# Altium schematic sheet Shels_System_ADP.SchDoc
size A4; SheetNumber: 1; SheetTotal: 1
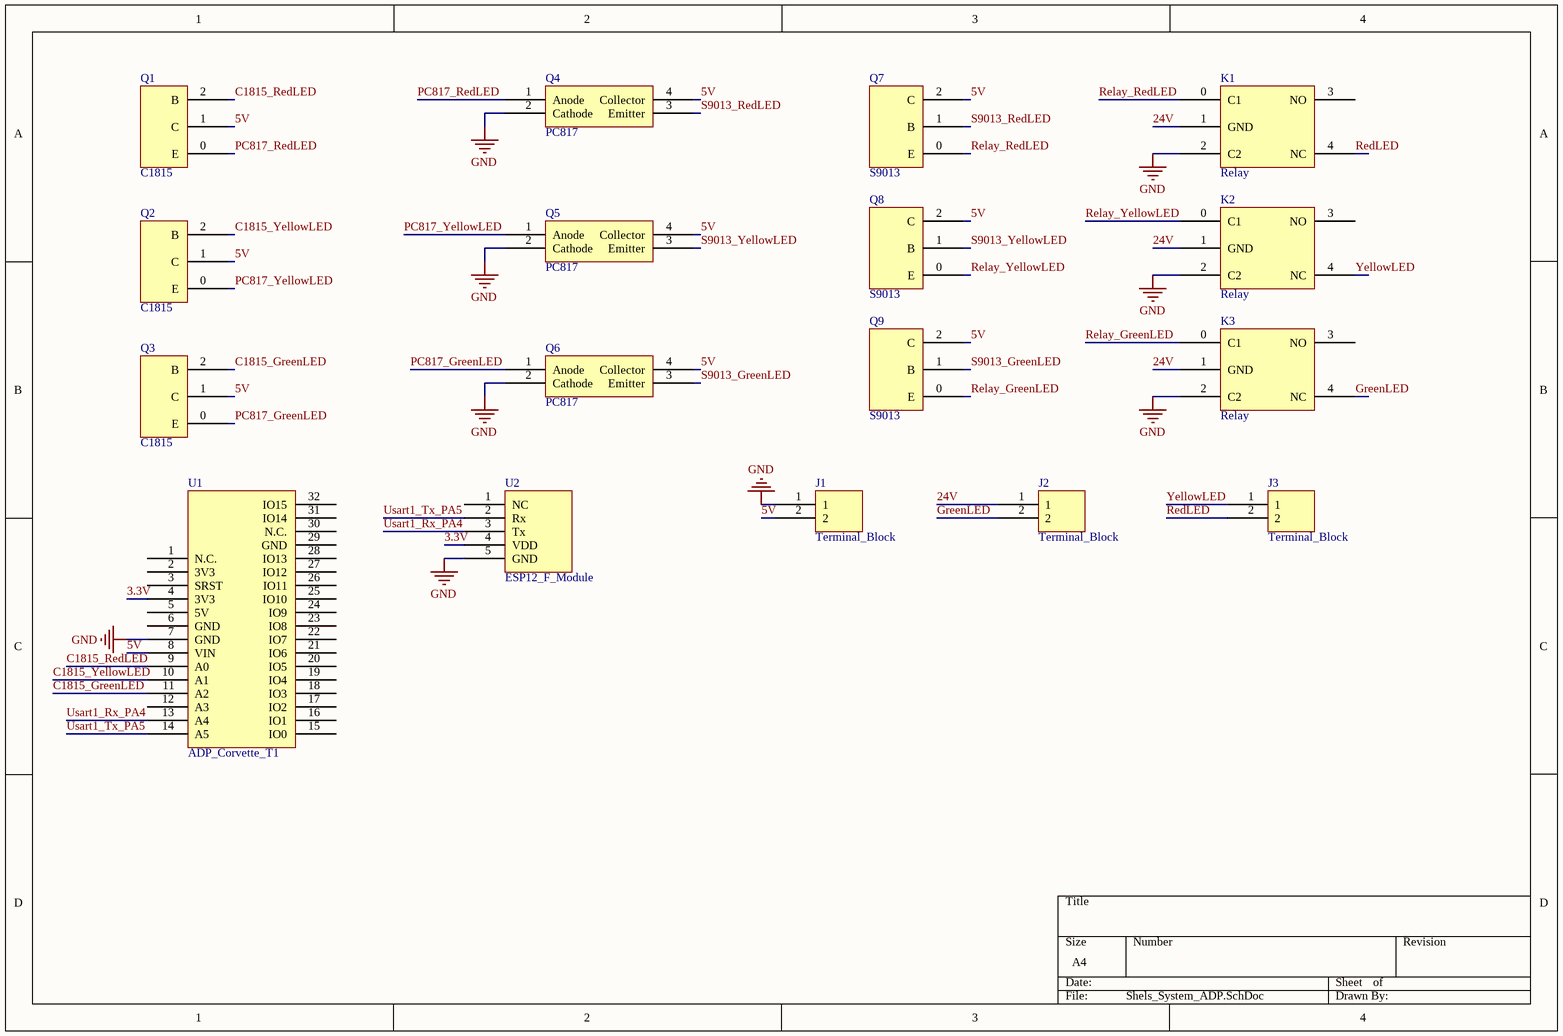
[diagram p0: Shels_System_ADP.SchDoc]

## Parts
J1  Terminal_Block  [terminal block]
J2  Terminal_Block  [terminal block]
J3  Terminal_Block  [terminal block]
K1  Relay  [Relay]
K2  Relay  [Relay]
K3  Relay  [Relay]
Q1  C1815  [C1815]
Q2  C1815  [C1815]
Q3  C1815  [C1815]
Q4  PC817  [PC817]
Q5  PC817  [PC817]
Q6  PC817  [PC817]
Q7  S9013  [S9013]
Q8  S9013  [S9013]
Q9  S9013  [S9013]
U1  ADP_Corvette_T1  [Corvette_T1]
U2  ESP12_F_Module  [ESP12_F_Holtek]

## Nets
GND: J1.1 K1.2(C2) K2.2(C2) K3.2(C2) Q4.2(Cathode) Q5.2(Cathode) Q6.2(Cathode) U1.7(GND) U2.5(GND)
3.3V: U1.4(3V3) U2.4(VDD)
5V: J1.2 Q1.1(C) Q2.1(C) Q3.1(C) Q4.4(Collector) Q5.4(Collector) Q6.4(Collector) Q7.2(C) Q8.2(C) Q9.2(C) U1.8(VIN)
24V: J2.1 K1.1(GND) K2.1(GND) K3.1(GND)
C1815_GreenLED: Q3.2(B) U1.11(A2)
C1815_RedLED: Q1.2(B) U1.9(A0)
C1815_YellowLED: Q2.2(B) U1.10(A1)
GreenLED: J2.2 K3.4(NC)
PC817_GreenLED: Q3.0(E) Q6.1(Anode)
PC817_RedLED: Q1.0(E) Q4.1(Anode)
PC817_YellowLED: Q2.0(E) Q5.1(Anode)
RedLED: J3.2 K1.4(NC)
Relay_GreenLED: K3.0(C1) Q9.0(E)
Relay_RedLED: K1.0(C1) Q7.0(E)
Relay_YellowLED: K2.0(C1) Q8.0(E)
S9013_GreenLED: Q6.3(Emitter) Q9.1(B)
S9013_RedLED: Q4.3(Emitter) Q7.1(B)
S9013_YellowLED: Q5.3(Emitter) Q8.1(B)
Usart1_Rx_PA4: U1.13(A4) U2.3(Tx)
Usart1_Tx_PA5: U1.14(A5) U2.2(Rx)
YellowLED: J3.1 K2.4(NC)

Not connected (* = marked no-connect by the designer): K1 3(NO); K2 3(NO); K3 3(NO); U1 1(N.C.) 2(3V3) 3(SRST) 5(5V) 6(GND) 12(A3) 15(IO0) 16(IO1) 17(IO2) 18(IO3) 19(IO4) 20(IO5) 21(IO6) 22(IO7) 23(IO8) 24(IO9) 25(IO10) 26(IO11) 27(IO12) 28(IO13) 29(GND) 30(N.C.) 31(IO14) 32(IO15); U2 1(NC)

## Library data of the parts
J1-J3 = Terminal Block
U1 = Corvette_T1
U2 = ESP12_F_Holtek